# EAGLE design TSALC (EAGLE 9.3.2)
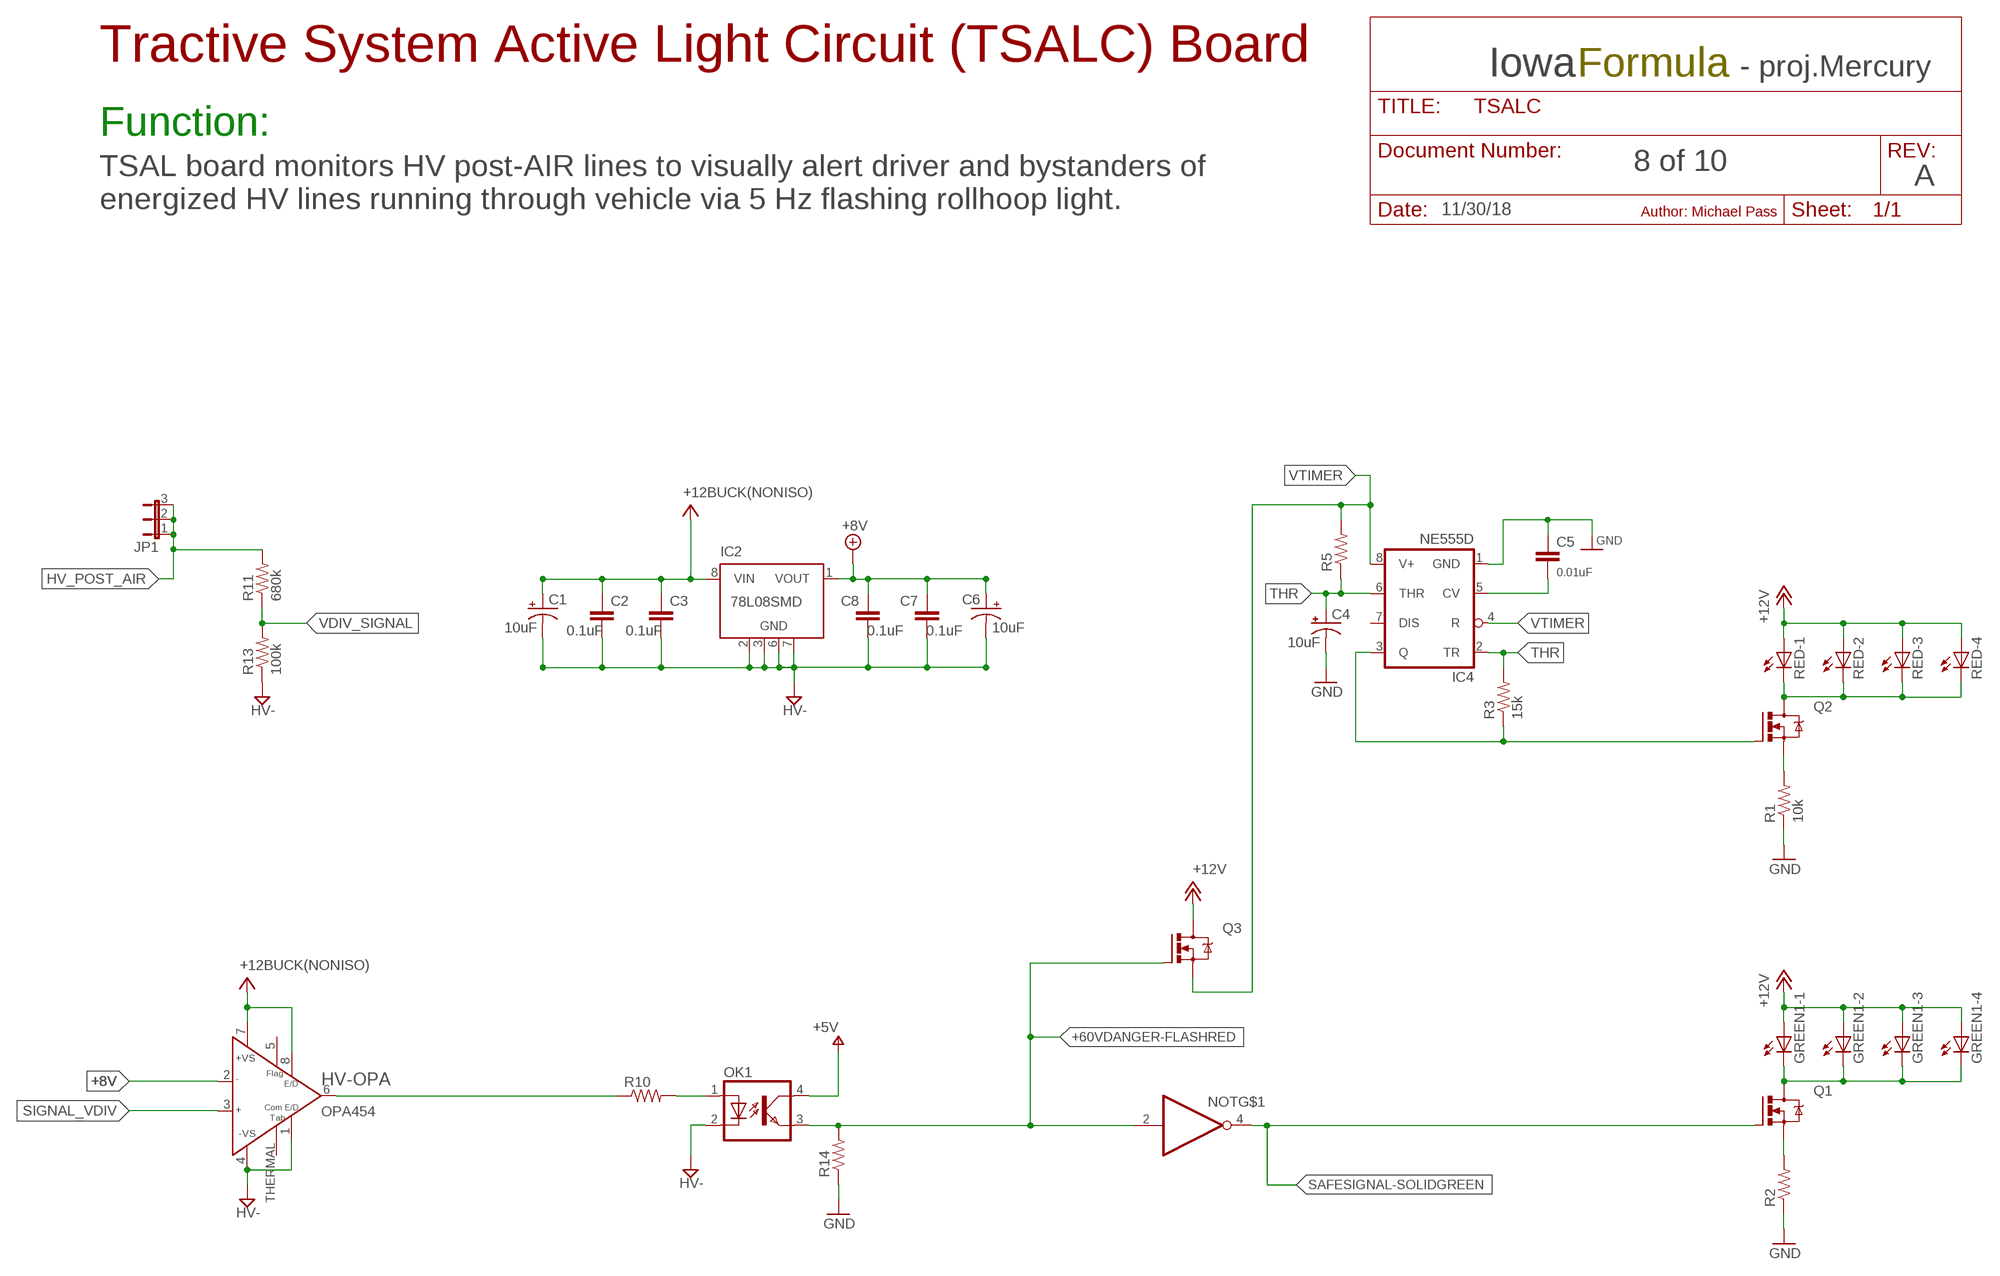
[diagram p0: schematic, sheet 1]

## Parts
C1  10uF  CPOL-US085CS-1AW  [085CS_1AW]
C2  0.1uF  C-EUC0805  [C0805]
C3  0.1uF  C-EUC0805  [C0805]
C4  10uF  CPOL-US085CS-1AW  [085CS_1AW]
C5  0.01uF  C-EUC0805  [C0805]
C6  10uF  CPOL-US085CS-1AW  [085CS_1AW]
C7  0.1uF  C-EUC0805  [C0805]
C8  0.1uF  C-EUC0805  [C0805]
GREEN1  LZR184  [LZR184]
HV-OPA  OPA454  [SO08GP]
IC2  78L08SMD  [SO08]
IC4  NE555D  [SO08]
JP1  JP2W  [JP2W]
NOT  74LVC1G06DCK  [SC70-5]
OK1  PC817-S  [SOP04(2.54)]
Q1  IRLZ44Z  [TO220BH]
Q2  IRLZ44Z  [TO220BH]
Q3  IRLZ44Z  [TO220BH]
R1  10k  R-US_R0805  [R0805]
R2  R-US_R0805  [R0805]
R3  15k  R-US_R0805  [R0805]
R5  R-US_R0805  [R0805]
R10  R-US_R0805  [R0805]
R11  680k  R-US_R0805  [R0805]
R13  100k  R-US_R0805  [R0805]
R14  R-US_R0805  [R0805]
RED  LZR184  [LZR184]

## Nets
+8V: C6.+ C7.1 C8.1 HV-OPA.2(IN-) IC2.1(VOUT)
+12V: GREEN1.A1(-1:A) GREEN1.A2(-2:A) GREEN1.A3(-3:A) GREEN1.A4(-4:A) Q3.D RED.A1(-1:A) RED.A2(-2:A) RED.A3(-3:A) RED.A4(-4:A)
+60VDANGER-FLASHRED: NOT.2(I) OK1.3(EMIT) Q3.G R14.2
GND: C4.- C5.1 IC4.1(GND) OK1.2(C) R1.1 R2.1 R13.1 R14.1 ; supply symbol labelled HV-
HV-: C1.- C2.2 C3.2 C6.- C7.2 C8.2 HV-OPA.1(E/DCOM) HV-OPA.4(-VS) IC2.2(GND) IC2.3(GND) IC2.6(GND) IC2.7(GND)
HV_POST_AIR: JP1.1 JP1.2 JP1.3 R11.2
N$3: GREEN1.K1(-1:C) GREEN1.K2(-2:C) GREEN1.K3(-3:C) GREEN1.K4(-4:C) Q1.D
N$4: Q1.S R2.2
N$5: Q2.D RED.K1(-1:C) RED.K2(-2:C) RED.K3(-3:C) RED.K4(-4:C)
N$6: Q2.S R1.2
N$7: C5.2 IC4.5(CV)
N$8: IC4.3(Q) Q2.G R3.1
N$9: HV-OPA.6(OUT) R10.1
N$10: OK1.1(A) R10.2
SAFESIGNAL-SOLIDGREEN: NOT.4(O) Q1.G
SIGNAL_VDIV: HV-OPA.3(IN+)
THR: C4.+ IC4.2(TR) IC4.6(THR) R3.2 R5.1
V+: C1.+ C2.1 C3.1 HV-OPA.7(+VS) HV-OPA.8(E/D) IC2.8(VIN) OK1.4(COL) ; supply symbol labelled +12BUCK(NONISO), +5V
VDIV_SIGNAL: R11.1 R13.2
VTIMER: IC4.4(R) IC4.8(V+) Q3.S R5.2
Unconnected: HV-OPA.5(STATUS) HV-OPA.THERMAL(E/DCOM1) IC2.4(NC) IC2.5(NC) IC4.7(DIS)

## Notes on the sheet
- Tractive System Active Light Circuit (TSALC) Board
- Iowa | Formula | - proj.Mercury
- Function:
- 8 of 10
- A
- TSAL board monitors HV post-AIR lines to visually alert driver and bystanders of 
  energized HV lines running through vehicle via 5 Hz flashing rollhoop light.
- 11/30/18 | Author: Michael Pass

## Power pins joined to a net without a drawn wire
HV-: NOT.3(GND)
VCC: NOT.5(VCC)

## Library data of the parts
C1 C4 C6 = rcl:CPOL-US: POLARIZED CAPACITOR, American symbol; SPICEPREFIX: C
C2 C3 C5 C7 C8 = rcl:C-EU: CAPACITOR, European symbol; SPICEPREFIX: C
GREEN1 RED = led:LZR184: LED BLOCK 4 LEDs, Siemens
HV-OPA = OPA454:OPA454: TexasInstruments High-Voltage (100V), High-Current (50mA) Operatioanl Amplifier, G = 1 Stable http://focus.ti.com/lit/ds/symlink/opa454.pdf; AVAILABILITY: Unavailable; DESCRIPTION: High Voltage _100V_ High-Current _50mA_ Operational Amplifiers G=1 Stable; MF: Texas Instruments; MP: OPA454; PACKAGE: None; PRICE: None
IC2 = linear:78L*SMD: Positive VOLTAGE REGULATOR
IC4 = linear:*555: TIMER
JP1 = jumper:JP2W: JUMPER
NOT = 74xx-little-us:74*1G06: Single Inverter Buffer/Driver With Open-Drain Output
OK1 = iowaFormula:PC817-S: SHARP OPTO COUPLER
Q1-Q3 = transistor-power:IRLZ44Z: N-Channel HEXFET® Power MOSFET Logic Level AUTOMOTIVE MOSFET Source: http://www.irf.com/product-info/datasheets/data/irlz44zpbf.pdf
R1-R3 R5 R10 R11 R13 R14 = rcl:R-US_: RESISTOR, American symbol; SPICEPREFIX: R

## Board
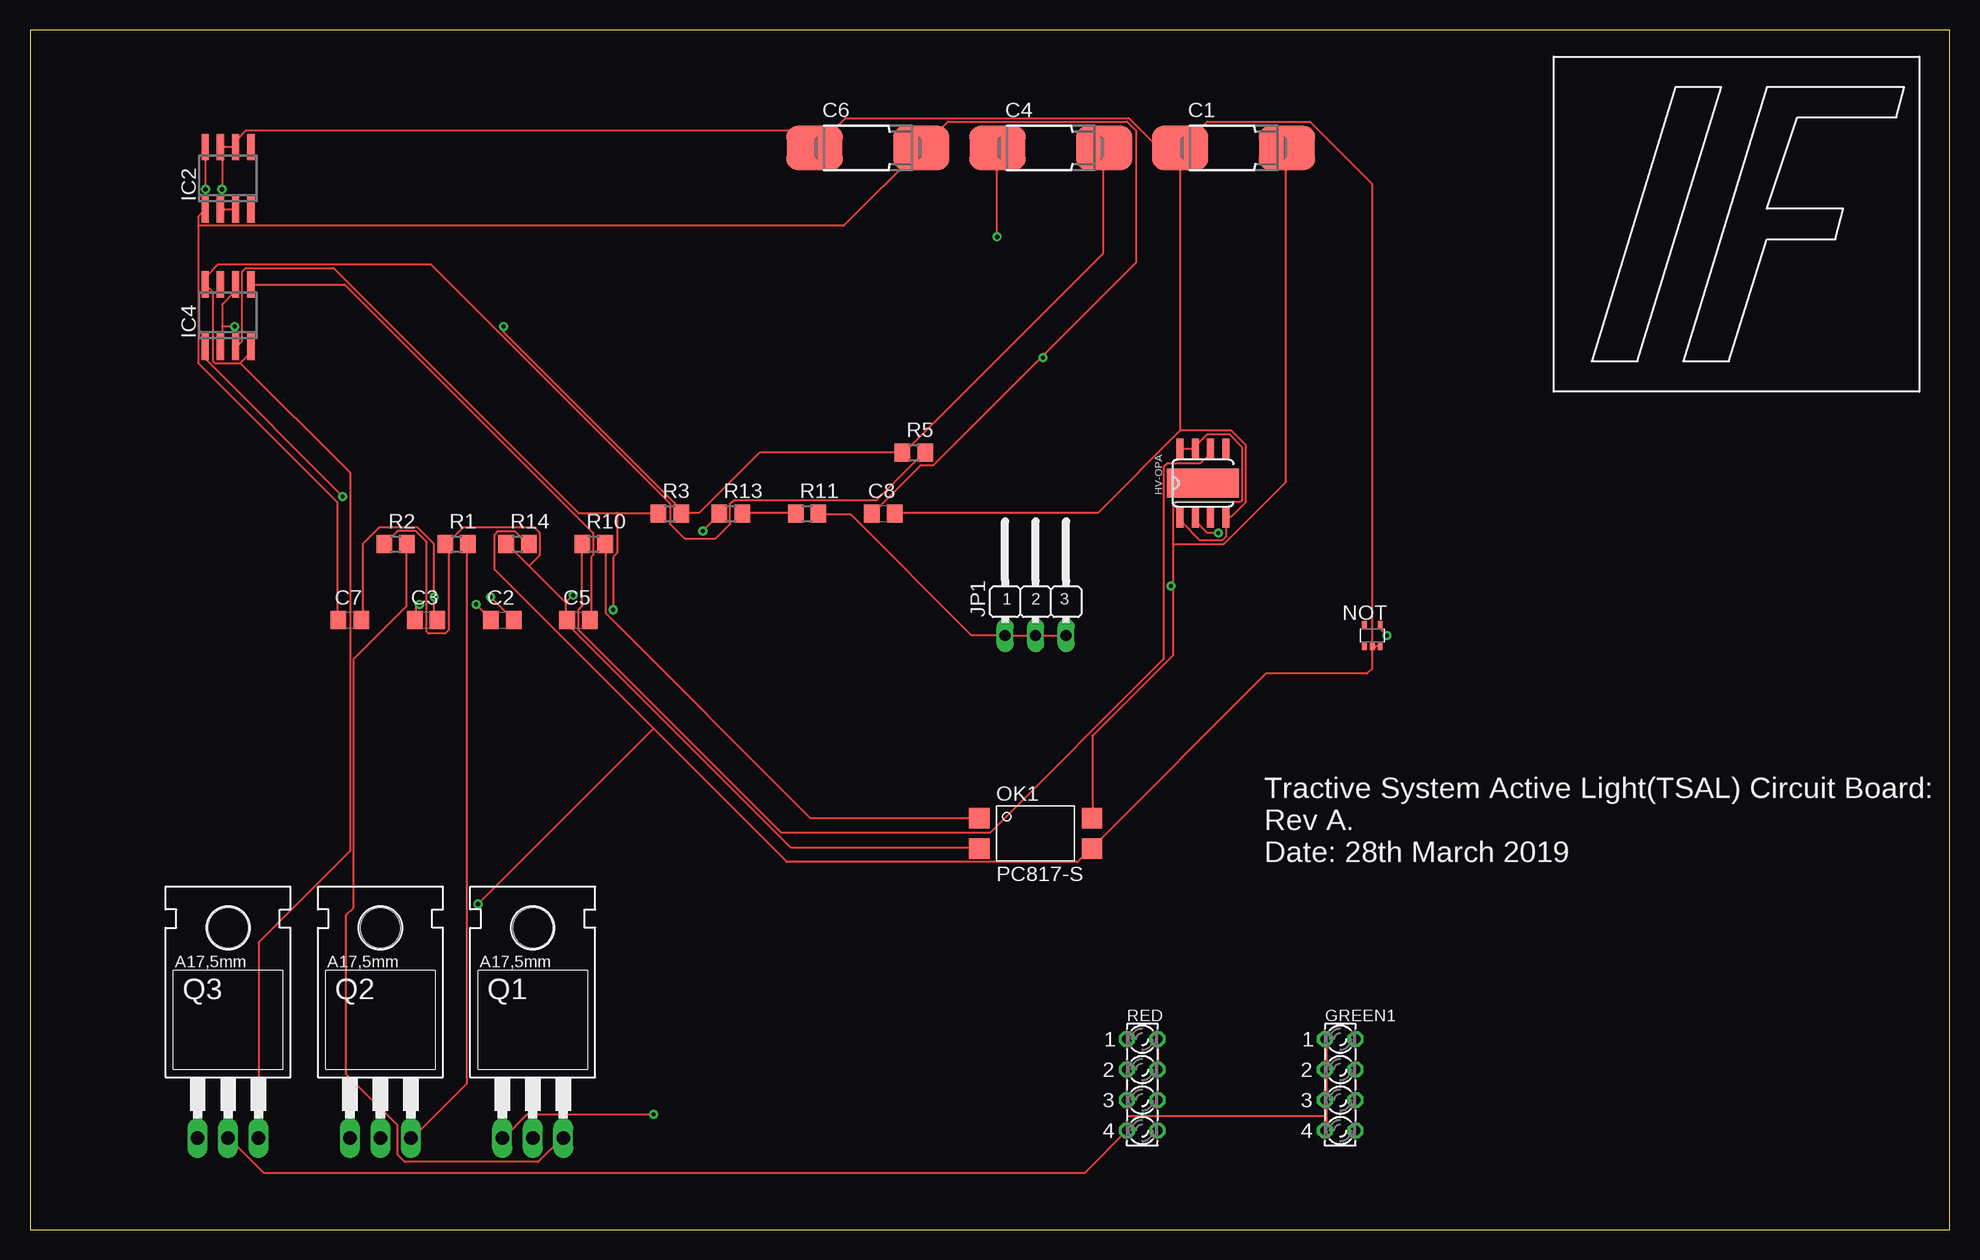
[diagram p1: board, top side]
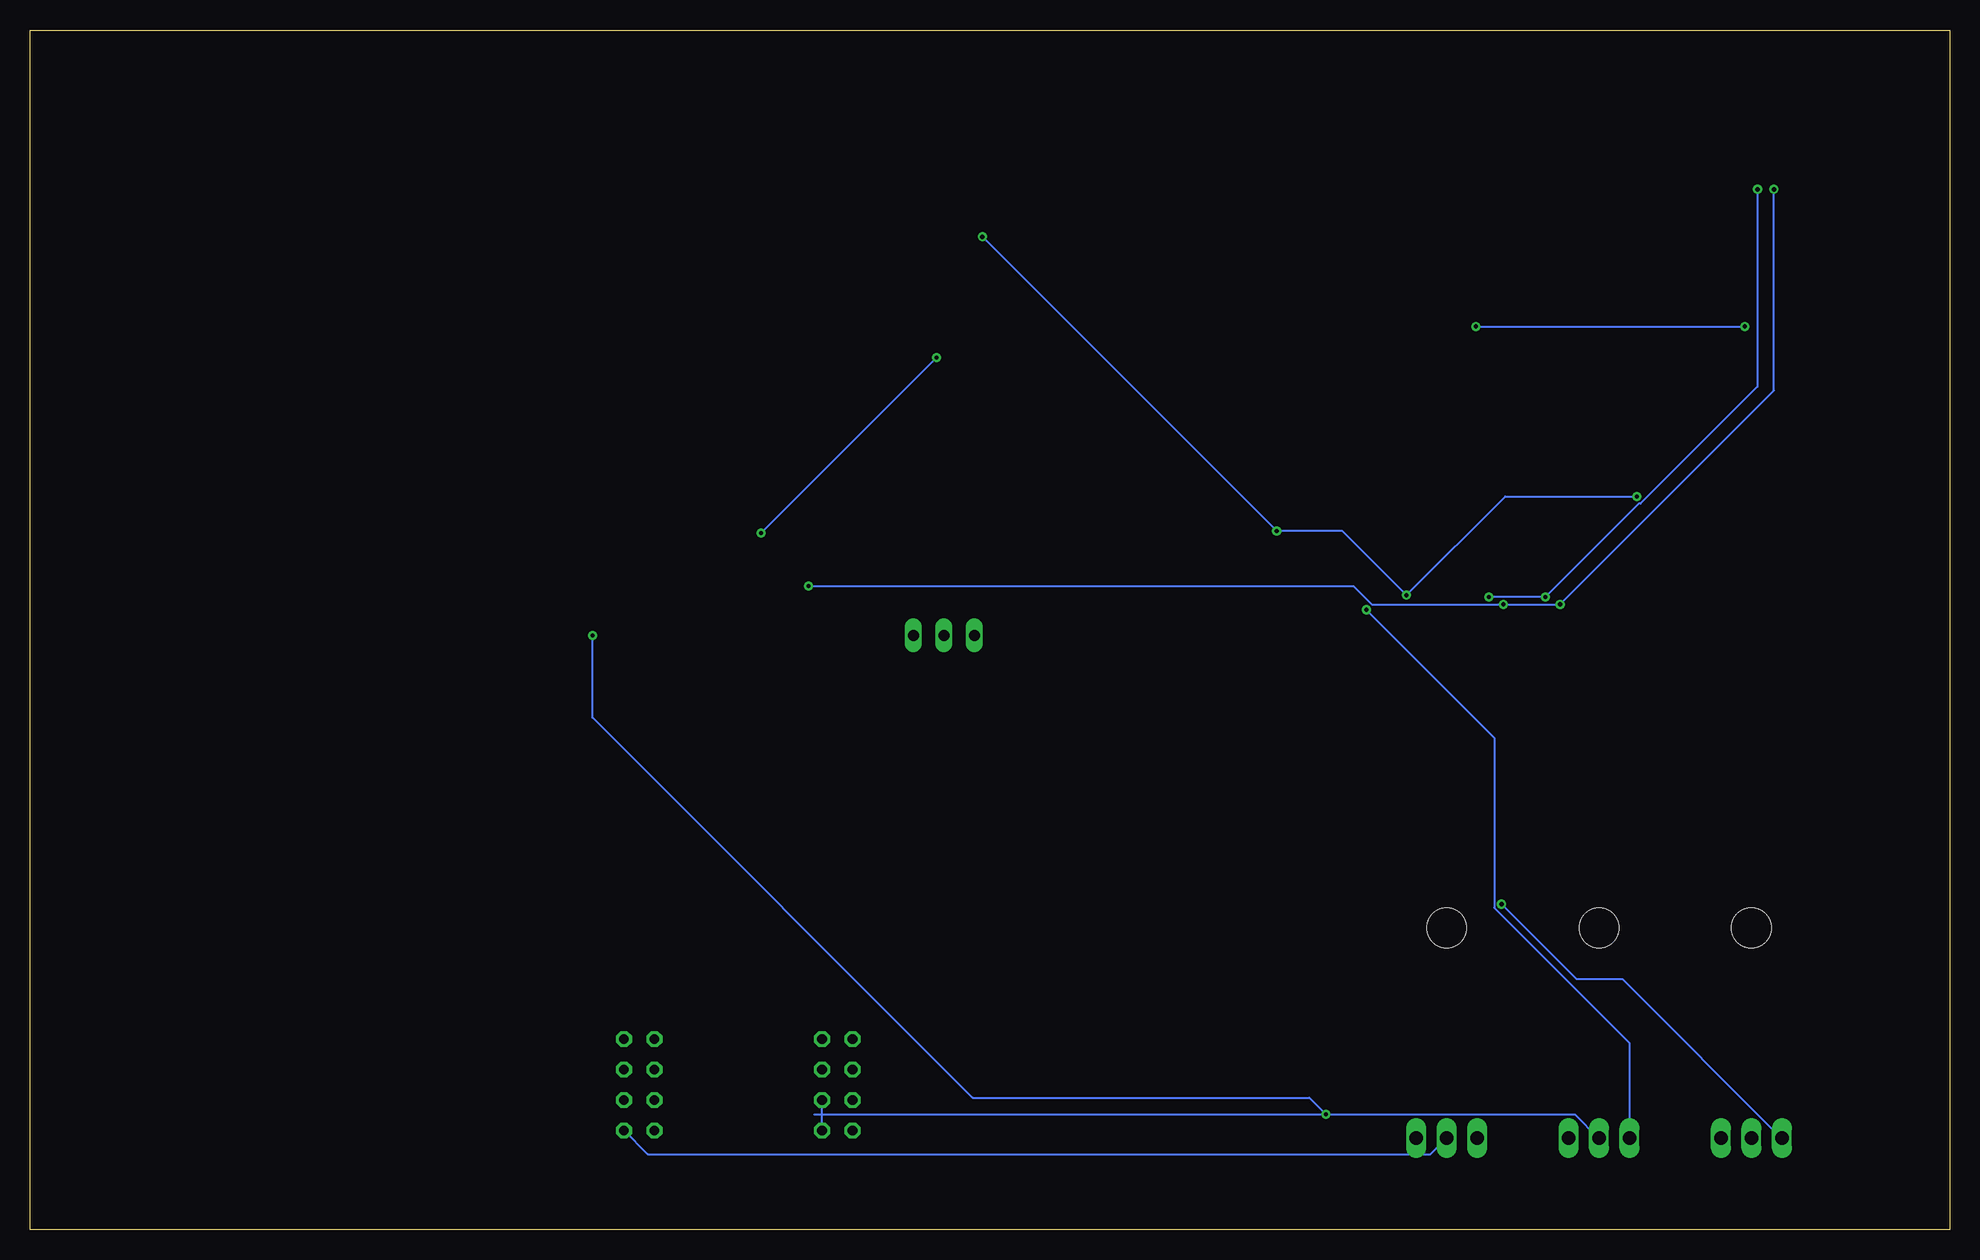
[diagram p2: board, bottom side, seen from below]

Size 160 x 100 mm. Coordinates in mm from the lower left corner, seen from the top.
Outline: 0,0 160,0 160,100 0,100 0,0
Copper layers (1*16): Top 0.035mm / dielectric 1.5mm / Bottom 0.035mm
Design rules "default": minimum track width 6mil, minimum drill 0.35mm, track to track 6mil, track to pad 6mil, pad to pad 6mil, via to via 6mil, smd to smd 6mil, copper to edge 40mil, drill to drill 6mil, minimum pad ring 10mil, minimum via ring 8mil, stop-mask expansion 4mil, vias tented up to drill 0mil, thermal gap 10mil

### Footprints (pad centres in the part's own frame; a part is rotated, then mirrored left to right if it is on the bottom)
085CS_1AW = smd 4.7 x 3.7: + 4.45,0; - -4.45,0
C0805 = smd 1.3 x 1.5: 1 -0.95,0; 2 0.95,0
LZR184 = drill 0.813 octagon: A1 -1.27,3.81; A2 -1.27,1.27; A3 -1.27,-1.27; A4 -1.27,-3.81; K1 1.27,3.81; K2 1.27,1.27; K3 1.27,-1.27; K4 1.27,-3.81
SO08GP = smd 0.6 x 1.8: 1 -1.925,-2.8; 2 -0.655,-2.8; 3 0.615,-2.8; 4 1.885,-2.8; 5 1.885,2.8; 6 0.615,2.8; 7 -0.655,2.8; 8 -1.925,2.8 | smd 6 x 2.4: THERMAL 0,0
SO08 = smd 0.6 x 2.2: 1 -1.905,-2.6; 2 -0.635,-2.6; 3 0.635,-2.6; 4 1.905,-2.6; 5 1.905,2.6; 6 0.635,2.6; 7 -0.635,2.6; 8 -1.905,2.6
JP2W = drill 0.914 long: 1 -2.54,-1.27; 2 0,-1.27; 3 2.54,-1.27
SC70-5 = smd 0.4 x 0.7: 1 -0.65,-0.85; 2 0,-0.85; 3 0.65,-0.85; 4 0.65,0.85; 5 -0.65,0.85
SOP04(2.54) = smd 1.68 x 1.71: 1 -4.692,1.27; 2 -4.692,-1.27; 3 4.692,-1.27; 4 4.692,1.27
TO220BH = drill 1.118 long: D 0,-6.35; G -2.54,-6.35; S 2.54,-6.35 | hole 3.302: 0,11.176
R0805 = smd 1.3 x 1.5: 1 -0.95,0; 2 0.95,0

### Placement (x,y rotation side)
C1  100.33,90.17 0 top
C2  39.37,50.8 0 top
C3  33.02,50.8 0 top
C4  85.09,90.17 0 top
C5  45.72,50.8 0 top
C6  69.85,90.17 0 top
C7  26.67,50.8 0 top
C8  71.12,59.69 0 top
GREEN1  109.22,12.06 0 top
HV-OPA  97.79,62.23 0 top
IC2  16.51,87.63 0 top
IC4  16.51,76.2 0 top
JP1  83.82,50.8 0 top
NOT  111.89,49.53 0 top
OK1  83.82,33.02 0 top
Q1  41.91,13.97 0 top
Q2  29.21,13.97 0 top
Q3  16.51,13.97 0 top
R1  35.56,57.15 0 top
R2  30.48,57.15 0 top
R3  53.34,59.69 0 top
R5  73.66,64.77 0 top
R10  46.99,57.15 0 top
R11  64.77,59.69 0 top
R13  58.42,59.69 0 top
R14  40.64,57.15 0 top
RED  92.71,12.06 0 top

### Tracks (layer width: path | path; a pad name or v marks a point on that pad's centre or on a via)
+8V  (via drill 0.35)
  Top 0.152: 14.02,83.67 14.02,84.43 14.48,84.89 IC2.1 | 14.02,83.67 14.02,72.24 25.6,60.66 25.6,50.9 C7.1 | 84.28,72.69 92.2,80.62 92.2,91.59 91.44,92.35 76.5,92.35 74.37,90.22 C6.+ 74.22,90.07 67.82,83.67 14.02,83.67 | 84.28,72.69 75.29,63.7 74.22,63.7 70.26,59.74 C8.1 | v99.06,58.06 98.15,58.06 97.23,58.98 97.23,59.28 HV-OPA.2 | 84.28,72.69 v84.43,72.69
  Bottom 0.152: v84.43,72.69 v99.06,58.06
+12V
  Top 0.152: 108.05,9.47 108.05,10.69 GREEN1.A3 108.05,10.85 108.05,13.28 GREEN1.A2 108.05,13.44 108.05,15.88 GREEN1.A1 | 108.05,9.47 108.05,8.26 GREEN1.A4 | RED.A1 RED.A2 RED.A3 91.44,9.47 | 91.44,9.47 RED.A4 87.88,4.7 19.53,4.7 16.61,7.62 Q3.D | 91.44,9.47 108.05,9.47
+60VDANGER-FLASHRED  (via drill 0.35)
  Top 0.152: NOT.2 111.89,46.77 111.45,46.34 103.04,46.34 88.54,31.85 OK1.3 88.39,31.7 87.33,30.63 63.09,30.63 51.97,41.76 | 51.97,41.76 38.71,55.02 38.71,57.91 39.01,58.22 40.39,58.22 41.45,57.15 R14.2 | 51.97,41.76 v37.34,27.13
  Bottom 0.152: v37.34,27.13 31.09,20.88 27.28,20.88 14.02,7.62 Q3.G
GND  (via drill 0.35)
  Top 0.152: 34.75,57.15 34.9,57 34.9,49.99 34.59,49.68 33.22,49.68 33.07,49.84 33.07,57.3 32.16,58.22 30.63,58.22 29.57,57.15 R2.1 | 44.65,52.27 44.65,50.9 C5.1 44.81,50.75 44.81,50.44 63.4,31.85 79.1,31.85 OK1.2 | 41.6,55.32 39.78,57.15 R14.1 | 41.6,55.32 44.65,52.27 | v56.08,58.22 57.45,59.59 R13.1 | 44.65,52.27 v45.26,52.88 | v26.06,61.11 14.63,72.54 14.63,73.46 IC4.1 | v80.62,82.75 80.62,90.07 C4.- | 34.75,57.15 36.12,58.52 42.06,58.52 42.52,58.06 42.52,56.24 41.6,55.32 | 34.75,57.15 R1.1
  Bottom 0.152: v26.06,61.11 37.03,61.11 v45.26,52.88 50.6,58.22 v56.08,58.22 v80.62,82.75
HV-  (via drill 0.35)
  Top 0.152: 95.86,66.6 89,59.74 72.08,59.74 C8.2 | 95.86,66.6 100.13,66.6 101.35,65.38 101.35,60.66 100.13,59.44 99.82,59.44 HV-OPA.4 99.67,59.28 99.67,57.76 99.36,57.45 97.54,57.45 96.01,58.98 96.01,59.28 HV-OPA.1 | NOT.3 112.47,48.64 112.17,48.64 111.86,48.34 111.86,87.17 106.68,92.35 98.15,92.35 96.01,90.22 C1.- | 95.86,66.6 95.86,90.07 C1.- | C7.2 27.74,50.9 27.74,57.15 29.11,58.52 32.31,58.52 33.68,57.15 v33.68,52.73 33.68,51.05 33.83,50.9 C3.2 | v38.41,52.73 40.23,50.9 C2.2 | 16,85.04 17.07,85.04 IC2.3 | 16,90.22 17.07,90.22 IC2.6 17.22,90.37 17.22,90.83 17.98,91.59 64.01,91.59 65.38,90.22 C6.- 65.53,90.22 67.97,92.66 91.59,92.66 94.03,90.22 95.86,90.22 C1.- | 16,90.22 v16,86.72 16,85.04 | 16,85.04 IC2.2 | 16,90.22 IC2.7
  Bottom 0.152: v38.41,52.73 v33.68,52.73 25.91,60.5 25.76,60.5 16,70.26 v16,86.72
HV_POST_AIR
  Top 0.152: R11.2 65.84,59.59 68.43,59.59 78.49,49.53 JP1.1 JP1.2 JP1.3
N$3
  Top 0.152: GREEN1.K1 GREEN1.K2 GREEN1.K3 GREEN1.K4
  Bottom 0.152: Q1.D 43.26,6.27 108.51,6.27 GREEN1.K4
N$4
  Top 0.152: R2.2 31.39,57.15 31.39,51.97 26.98,47.55 26.98,26.82 26.36,26.21 26.36,12.95 30.63,8.69 30.63,6.25 31.24,5.64 42.37,5.64 44.35,7.62 Q1.S
N$5
  Top 0.152: RED.K1 94.03,15.88 94.03,13.44 RED.K2 94.03,13.28 94.03,10.85 RED.K3
  Bottom 0.152: RED.K4 94.03,8.26 94.03,10.69 RED.K3 | 94.64,9.6 31.24,9.6 29.26,7.62 Q2.D
N$6
  Top 0.152: R1.2 36.42,57.15 36.42,12.19 31.85,7.62 Q2.S
N$7
  Top 0.152: C5.2 46.79,50.9 46.79,56.08 46.94,56.24 46.94,58.06 26.21,78.79 18.44,78.79 IC4.5
N$8  (via drill 0.35)
  Top 0.152: 48.92,59.74 45.72,59.74 25.3,80.16 17.98,80.16 17.68,79.86 17.68,74.07 17.22,73.61 IC4.3 | 48.92,59.74 52.27,59.74 R3.1 | v48.62,51.66 48.62,56.08 48.92,56.39 48.92,59.74
  Bottom 0.152: Q2.G 26.67,15.54 37.95,26.82 37.95,41 v48.62,51.66
N$9
  Top 0.152: R10.1 46.02,57.15 46.02,51.97 45.72,51.66 45.72,49.99 62.64,33.07 80.01,33.07 94.49,47.55 94.49,63.55 94.79,63.86 97.54,63.86 98.3,64.62 98.3,64.92 HV-OPA.6
N$10
  Top 0.152: OK1.1 65.08,34.29 48.01,51.36 48.01,57.15 R10.2
SAFESIGNAL-SOLIDGREEN  (via drill 0.35)
  Top 0.152: v113.11,49.53 112.65,49.99 112.65,50.29 NOT.4 | v51.97,9.6 41.45,9.6 39.47,7.62 Q1.G
  Bottom 0.152: v113.11,49.53 113.11,42.67 81.43,11 53.37,11 v51.97,9.6
THR  (via drill 0.35)
  Top 0.152: 16,75.29 16,77.11 17.07,78.18 17.07,78.79 IC4.6 | 16,75.29 16,73.61 IC4.2 | 54.56,59.74 55.78,59.74 60.81,64.77 R5.1 72.85,64.77 89.46,81.38 89.46,90.07 C4.+ | 54.56,59.74 54.41,59.74 R3.2 54.56,59.74 | v17.07,75.29 16,75.29 | v39.47,75.29 39.47,74.83 54.56,59.74
  Bottom 0.152: v39.47,75.29 v17.07,75.29
V+  (via drill 0.35)
  Top 0.152: v32.46,52.12 32.16,51.82 32.16,50.9 C3.1 | v37.19,52.12 38.41,50.9 C2.1 | v14.63,86.72 14.63,90.22 IC2.8 | 95.25,57.15 95.25,60.35 95.56,60.66 100.89,60.66 101.04,60.81 101.04,65.23 99.97,66.29 98.15,66.29 97.23,65.38 97.23,65.08 HV-OPA.7 97.08,65.08 96.01,65.08 HV-OPA.8 | 95.25,57.15 95.25,53.65 | 95.25,53.65 95.25,47.85 88.54,41.15 88.54,34.29 OK1.4 | 95.25,57.15 99.52,57.15 104.7,62.33 104.7,90.07 C1.+ | 95.25,53.65 v95.1,53.65
  Bottom 0.152: v14.63,86.72 14.63,69.95 v32.46,52.12 v37.19,52.12 48.16,52.12 49.68,53.65 v95.1,53.65
VDIV_SIGNAL
  Top 0.152: R13.2 59.44,59.74 63.7,59.74 R11.1
VTIMER
  Top 0.152: R5.2 74.52,64.77 70.56,60.81 58.67,60.81 58.37,60.5 58.37,58.83 57.15,57.61 54.56,57.61 53.34,58.83 53.34,60.5 33.38,80.47 15.7,80.47 14.63,79.4 14.63,78.94 IC4.8 14.63,78.79 15.24,78.18 15.24,72.39 15.39,72.24 17.53,72.24 | 17.53,72.24 18.29,73 18.29,73.46 IC4.4 | Q3.S 19.05,23.93 26.67,31.55 26.67,63.09 17.53,72.24

### Text on the board
tNames: Tractive System Active Light(TSAL) Circuit Board: / Rev A. / Date: 28th March 2019